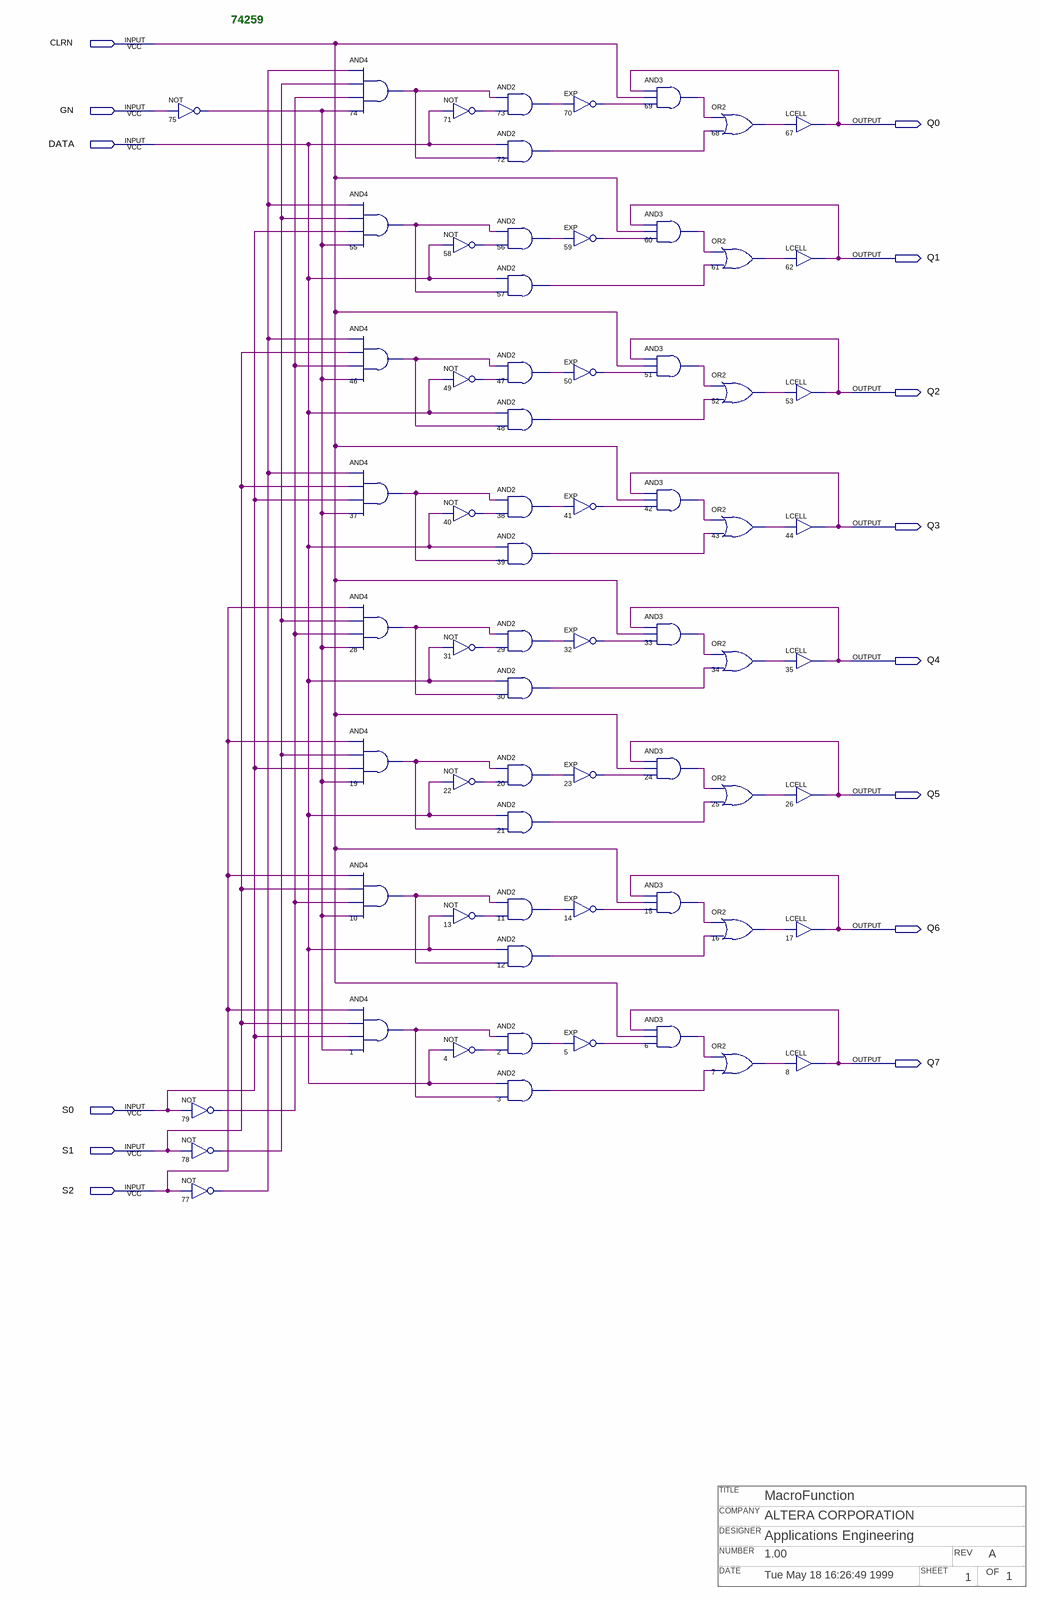
[diagram p0: schematic sheet]
// Quartus schematic 74259.bdf as structural Verilog: 68 symbols, 14 pins
// Title block: TITLE: MacroFunction; COMPANY: ALTERA CORPORATION; DESIGNER: Applications Engineering; NUMBER: 1.00; REV: A; DATE: Tue May 18 16:26:49 1999; SHEET: 1; OF: 1
module \74259  (
  input  CLRN,
  input  GN,
  input  DATA,
  input  S0,
  input  S1,
  input  S2,
  output Q0,
  output Q1,
  output Q2,
  output Q3,
  output Q4,
  output Q5,
  output Q6,
  output Q7
);

  wire n1_out, n2_out, n3_out, n4_out, n5_out, n6_out, n7_out, n10_out, n11_out, n12_out, n13_out, n14_out,
       n15_out, n16_out, n19_out, n20_out, n21_out, n22_out, n23_out, n24_out, n25_out, n28_out, n29_out,
       n30_out, n31_out, n32_out, n33_out, n34_out, n37_out, n38_out, n39_out, n40_out, n41_out, n42_out,
       n43_out, n46_out, n47_out, n48_out, n49_out, n50_out, n51_out, n52_out, n55_out, n56_out, n57_out,
       n58_out, n59_out, n60_out, n61_out, n68_out, n69_out, n70_out, n71_out, n72_out, n73_out, n74_out,
       n75_out, n77_out, n78_out, n79_out;

  not u_75 (n75_out, GN);
  not u_79 (n79_out, S0);
  not u_78 (n78_out, S1);
  not u_77 (n77_out, S2);
  and u_74 (n74_out, n77_out, n78_out, n79_out, n75_out);
  and u_55 (n55_out, n77_out, n78_out, S0, n75_out);
  and u_46 (n46_out, n77_out, S1, n79_out, n75_out);
  and u_37 (n37_out, n77_out, S1, S0, n75_out);
  and u_28 (n28_out, S2, n78_out, n79_out, n75_out);
  and u_19 (n19_out, S2, n78_out, S0, n75_out);
  and u_10 (n10_out, S2, S1, n79_out, n75_out);
  and u_1 (n1_out, S2, S1, S0, n75_out);
  not u_71 (n71_out, DATA);
  not u_58 (n58_out, DATA);
  not u_49 (n49_out, DATA);
  not u_40 (n40_out, DATA);
  not u_31 (n31_out, DATA);
  not u_22 (n22_out, DATA);
  not u_13 (n13_out, DATA);
  not u_4 (n4_out, DATA);
  and u_73 (n73_out, n74_out, n71_out);
  and u_72 (n72_out, DATA, n74_out);
  and u_56 (n56_out, n55_out, n58_out);
  and u_57 (n57_out, DATA, n55_out);
  and u_47 (n47_out, n46_out, n49_out);
  and u_48 (n48_out, DATA, n46_out);
  and u_38 (n38_out, n37_out, n40_out);
  and u_39 (n39_out, DATA, n37_out);
  and u_29 (n29_out, n28_out, n31_out);
  and u_30 (n30_out, DATA, n28_out);
  and u_20 (n20_out, n19_out, n22_out);
  and u_21 (n21_out, DATA, n19_out);
  and u_11 (n11_out, n10_out, n13_out);
  and u_12 (n12_out, DATA, n10_out);
  and u_2 (n2_out, n1_out, n4_out);
  and u_3 (n3_out, DATA, n1_out);
  EXP u_70 (.IN(n73_out), .OUT(n70_out));
  EXP u_59 (.IN(n56_out), .OUT(n59_out));
  EXP u_50 (.IN(n47_out), .OUT(n50_out));
  EXP u_41 (.IN(n38_out), .OUT(n41_out));
  EXP u_32 (.IN(n29_out), .OUT(n32_out));
  EXP u_23 (.IN(n20_out), .OUT(n23_out));
  EXP u_14 (.IN(n11_out), .OUT(n14_out));
  EXP u_5 (.IN(n2_out), .OUT(n5_out));
  and u_69 (n69_out, Q0, CLRN, n70_out);
  and u_60 (n60_out, Q1, CLRN, n59_out);
  and u_51 (n51_out, Q2, CLRN, n50_out);
  and u_42 (n42_out, Q3, CLRN, n41_out);
  and u_33 (n33_out, Q4, CLRN, n32_out);
  and u_24 (n24_out, Q5, CLRN, n23_out);
  and u_15 (n15_out, Q6, CLRN, n14_out);
  and u_6 (n6_out, Q7, CLRN, n5_out);
  or u_68 (n68_out, n69_out, n72_out);
  or u_61 (n61_out, n60_out, n57_out);
  or u_52 (n52_out, n51_out, n48_out);
  or u_43 (n43_out, n42_out, n39_out);
  or u_34 (n34_out, n33_out, n30_out);
  or u_25 (n25_out, n24_out, n21_out);
  or u_16 (n16_out, n15_out, n12_out);
  or u_7 (n7_out, n6_out, n3_out);
  LCELL u_67 (.IN(n68_out), .OUT(Q0));
  LCELL u_62 (.IN(n61_out), .OUT(Q1));
  LCELL u_53 (.IN(n52_out), .OUT(Q2));
  LCELL u_44 (.IN(n43_out), .OUT(Q3));
  LCELL u_35 (.IN(n34_out), .OUT(Q4));
  LCELL u_26 (.IN(n25_out), .OUT(Q5));
  LCELL u_17 (.IN(n16_out), .OUT(Q6));
  LCELL u_8 (.IN(n7_out), .OUT(Q7));

  // Notes on the sheet:
  //   74259
endmodule
